# EAGLE schematic Micro-OLED_I2C_Mill_Humid_Test (EAGLE 7.6.0)
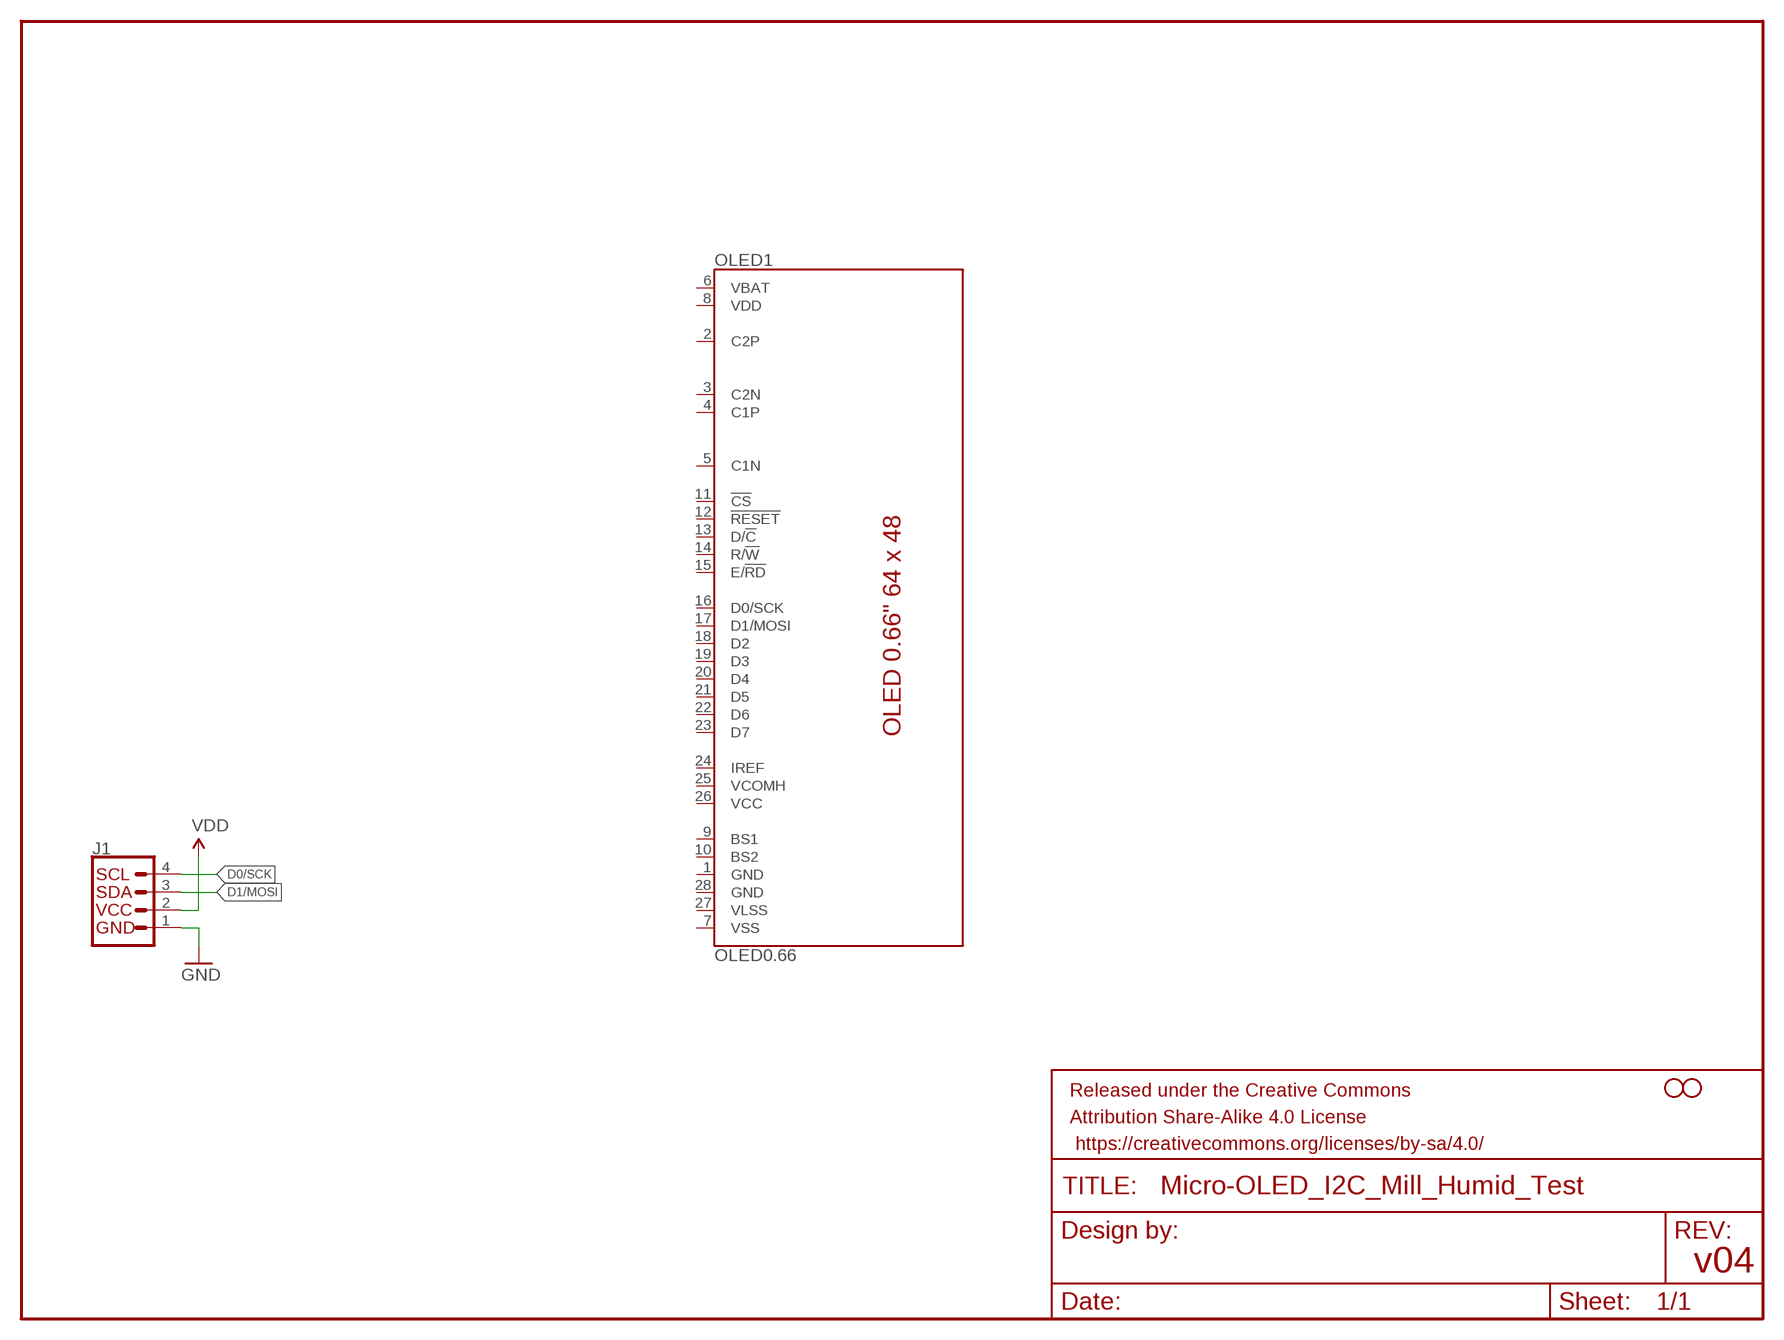
[diagram p0: schematic, sheet 1]

## Parts
FRAME1  FRAME-LETTER  [CREATIVE_COMMONS]
H1  STAND-OFF  [STAND-OFF]
H2  STAND-OFF  [STAND-OFF]
J1  I2C_STANDARDJS-1MM  [1X04_1MM_RA]
OLED1  OLED0.66  [OLED-0.66-64X48]

## Nets
D0/SCK: J1.4(SCL)
D1/MOSI: J1.3(SDA)
GND: J1.1(GND)
VDD: J1.2(VCC)
Unconnected: OLED1.1(GND) OLED1.2(C2P) OLED1.3(C2N) OLED1.4(C1P) OLED1.5(C1N) OLED1.6(VBAT) OLED1.7(VSS) OLED1.8(VDD) OLED1.9(BS1) OLED1.10(BS2) OLED1.11(!CS!) OLED1.12(!RESET!) OLED1.13(D/!C!) OLED1.14(R/!W!) OLED1.15(E/!RD!) OLED1.16(D0/SCK) OLED1.17(D1/MOSI) OLED1.18(D2) OLED1.19(D3) OLED1.20(D4) OLED1.21(D5) OLED1.22(D6) OLED1.23(D7) OLED1.24(IREF) OLED1.25(VCOMH) OLED1.26(VCC) OLED1.27(VLSS) OLED1.28(GND)

## Notes on the sheet
- v04

## Library data of the parts
FRAME1 = SparkFun-Aesthetics:FRAME-LETTER: Schematic Frame Standard 8.5x11 US Letter frame
H1 H2 = SparkFun-Hardware:STAND-OFF: Stand Off Drill holes for mechanically mounting via screws, standoffs, etc. Note: Use the keepout ring to avoid running the screw head into surrounding components. Variant Overviews STAND-OFF - Mechanical footprint for a #4 phillips button head screw. STAND-OFF-TIGHT - Mechanical footprint for a #4 phillips button head screw, Example SparkFun Products Screw - Phillips Head (1/4", 4-40, 10 pack) <https://www.sparkfun.com/products/10453> (PRT-10453) Screw - Phillips Head (1/2", 4-40, 10 pack) <https://www.sparkfun.com/products/10452> (PRT-10452) Screw - Phillips Head (3/4", 4-40, 10 pack) <https://www.sparkfun.com/products/10451> (PRT-10451) Screw - Phillips Head (1", 4-40, 10 pack) <https://www.sparkfun.com/products/10450> (PRT-10450)
J1 = SparkX:I2C_STANDARD: SparkFun I2C Standard Pinout Header SparkFun has standardized on a pinout for all I2C based sensor breakouts. This pinout allows I2C boards to be plugged directly into the headers on Arduino Uno compatible boards, and to be daisy chained easily. Example SparkFun Products: SparkFun Atmospheric Sensor Breakout - BME280 <https://www.sparkfun.com/products/13676> SparkFun Altitude/Pressure Sensor Breakout - MPL3115A2 <https://www.sparkfun.com/products/11084> SparkFun TOF Range Finder Sensor - VL6180 <https://www.sparkfun.com/products/12785>
OLED1 = microView-temp:OLED0.66